# Altium schematic sheet USB.SchDoc
size A4; SheetNumber: 3; SheetTotal: 6
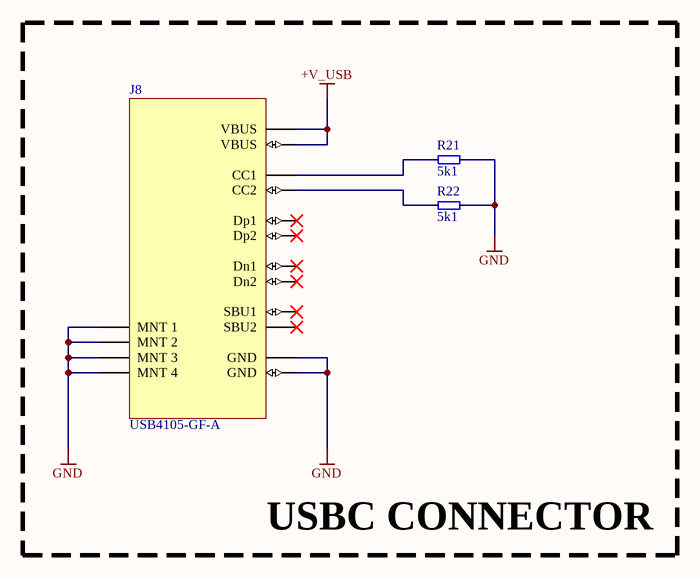
[diagram p0: USB.SchDoc]

## Parts
J8  USB4105-GF-A  [FP-USB4105-GF-A-MFG]
R21  5k1  [R0402]
R22  5k1  [R0402]

## Blocks framed on the sheet
USBC CONNECTOR: J8 R21 R22

## Nets
+V_USB: J8.A4-B9(VBUS) J8.B4-A9(VBUS)
GND: J8.1(MNT_1) J8.2(MNT_2) J8.3(MNT_3) J8.4(MNT_4) J8.A1-B12(GND) J8.B1-A12(GND) R21.2 R22.2
NetJ8_A5: J8.A5(CC1) R21.1
NetJ8_B5: J8.B5(CC2) R22.1

Not connected (* = marked no-connect by the designer): J8 A6(Dp1)* A7(Dn1)* A8(SBU1)* B6(Dp2)* B7(Dn2)* B8(SBU2)*

## Library data of the parts
J8 = CONN-00045-1: USB Connector, 24 Contact(s), Female, Right Angle, Solder Terminal, Locking, Receptacle; Manufacturer: GCT; Supplier: Mouser; Manufacturer PN: USB4105-GF-A; Supplier PN: 640-USB4105-GF-A
R21 R22 = CMP-00016-10: Generic 0402 SMD Resistor